# Altium schematic sheet Snippet of MS9333_Main.SchDoc
size A4
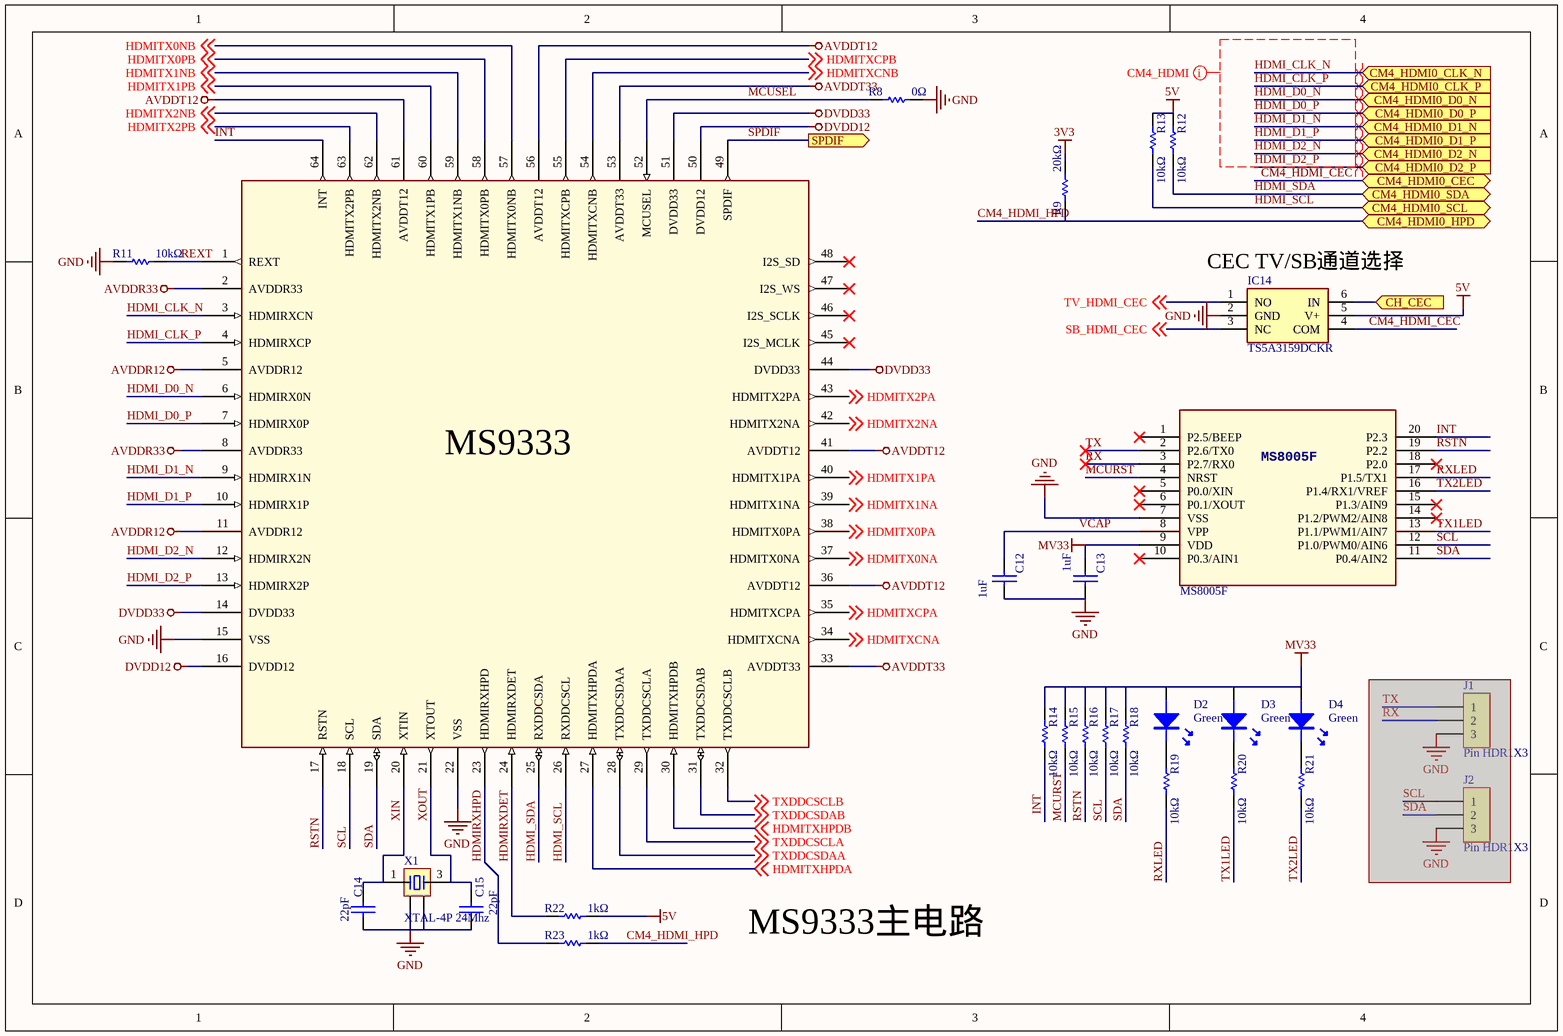
[diagram p0: Snippet of MS9333_Main.SchDoc]

## Parts
C12  1uF  [C_0402]
C13  1uF  [C_0402]
C14  22pF  [C_0402]
C15  22pF  [C_0402]
D2  Green  [LED-0603-G]
D3  Green  [LED-0603-G]
D4  Green  [LED-0603-G]
IC14  TS5A3159DCKR  [SOT65P210X110-6N]
J1  Pin HDR1X3  [Pin HDR1X3/2.54mm-S]  (masked out: inside a compile mask, not in the netlist)
J2  Pin HDR1X3  [Pin HDR1X3/2.54mm-S]  (masked out: inside a compile mask, not in the netlist)
R8  0Ω  [R_0402]
R9  20kΩ  [R_0402]
R11  10kΩ  [R_0402]
R12  10kΩ  [R_0402]
R13  10kΩ  [R_0402]
R14  10kΩ  [R_0402]
R15  10kΩ  [R_0402]
R16  10kΩ  [R_0402]
R17  10kΩ  [R_0402]
R18  10kΩ  [R_0402]
R19  10kΩ  [R_0402]
R20  10kΩ  [R_0402]
R21  10kΩ  [R_0402]
R22  1kΩ  [R_0402]
R23  1kΩ  [R_0402]
U2  MS9333  [LQFP64-0.5]  (value not drawn)
U3  MS8005F  [TSSOP20]
X1  XTAL-4P 24Mhz  [OSC 3225-4P]

## Ports
CH_CEC (in), CM4_HDMI0_CEC (bidir), CM4_HDMI0_CLK_N (in), CM4_HDMI0_CLK_P (in), CM4_HDMI0_D0_N (in), CM4_HDMI0_D0_P (in), CM4_HDMI0_D1_N (in), CM4_HDMI0_D1_P (in), CM4_HDMI0_D2_N (in), CM4_HDMI0_D2_P (in), CM4_HDMI0_HPD (bidir), CM4_HDMI0_SCL (bidir), CM4_HDMI0_SDA (bidir), SPDIF (out)

## Nets
3V3: R9.2
5V: IC14.5(V+) R12.1 R13.1 R22.2
AVDDR12: U2.5(AVDDR12) U2.11(AVDDR12)
AVDDR33: U2.2(AVDDR33) U2.8(AVDDR33)
AVDDT12: U2.36(AVDDT12) U2.41(AVDDT12) U2.56(AVDDT12) U2.61(AVDDT12)
AVDDT33: U2.33(AVDDT33) U2.53(AVDDT33)
DVDD12: U2.16(DVDD12) U2.50(DVDD12)
DVDD33: U2.14(DVDD33) U2.44(DVDD33) U2.51(DVDD33)
GND: C12.1 C13.2 C14.2 C15.2 IC14.2(GND) R8.2 R11.1 U2.15(VSS) U2.22(VSS) U3.7(VSS) X1.2 X1.4
MV33: C13.1 D2.A D3.A D4.A R14.1 R15.1 R16.1 R17.1 R18.1 U3.9(VDD)
CH_CEC: IC14.6(IN) ; port CH_CEC
CM4_HDMI_CEC: IC14.4(COM) ; port CM4_HDMI0_CEC
CM4_HDMI_HPD: R9.1 R23.2 ; port CM4_HDMI0_HPD
HDMI_CLK_N: U2.3(HDMIRXCN) ; port CM4_HDMI0_CLK_N
HDMI_CLK_P: U2.4(HDMIRXCP) ; port CM4_HDMI0_CLK_P
HDMI_D0_N: U2.6(HDMIRX0N) ; port CM4_HDMI0_D0_N
HDMI_D0_P: U2.7(HDMIRX0P) ; port CM4_HDMI0_D0_P
HDMI_D1_N: U2.9(HDMIRX1N) ; port CM4_HDMI0_D1_N
HDMI_D1_P: U2.10(HDMIRX1P) ; port CM4_HDMI0_D1_P
HDMI_D2_N: U2.12(HDMIRX2N) ; port CM4_HDMI0_D2_N
HDMI_D2_P: U2.13(HDMIRX2P) ; port CM4_HDMI0_D2_P
HDMI_SCL: R13.2 U2.26(RXDDCSCL) ; port CM4_HDMI0_SCL
HDMI_SDA: R12.2 U2.25(RXDDCSDA) ; port CM4_HDMI0_SDA
HDMIRXDET: R22.1 U2.24(HDMIRXDET)
HDMIRXHPD: R23.1 U2.23(HDMIRXHPD)
HDMITX0NA: U2.37(HDMITX0NA) ; off-sheet HDMITX0NA
HDMITX0NB: U2.57(HDMITX0NB) ; off-sheet HDMITX0NB
HDMITX0PA: U2.38(HDMITX0PA) ; off-sheet HDMITX0PA
HDMITX0PB: U2.58(HDMITX0PB) ; off-sheet HDMITX0PB
HDMITX1NA: U2.39(HDMITX1NA) ; off-sheet HDMITX1NA
HDMITX1NB: U2.59(HDMITX1NB) ; off-sheet HDMITX1NB
HDMITX1PA: U2.40(HDMITX1PA) ; off-sheet HDMITX1PA
HDMITX1PB: U2.60(HDMITX1PB) ; off-sheet HDMITX1PB
HDMITX2NA: U2.42(HDMITX2NA) ; off-sheet HDMITX2NA
HDMITX2NB: U2.62(HDMITX2NB) ; off-sheet HDMITX2NB
HDMITX2PA: U2.43(HDMITX2PA) ; off-sheet HDMITX2PA
HDMITX2PB: U2.63(HDMITX2PB) ; off-sheet HDMITX2PB
HDMITXCNA: U2.34(HDMITXCNA) ; off-sheet HDMITXCNA
HDMITXCNB: U2.54(HDMITXCNB) ; off-sheet HDMITXCNB
HDMITXCPA: U2.35(HDMITXCPA) ; off-sheet HDMITXCPA
HDMITXCPB: U2.55(HDMITXCPB) ; off-sheet HDMITXCPB
HDMITXHPDA: U2.27(HDMITXHPDA) ; off-sheet HDMITXHPDA
HDMITXHPDB: U2.30(HDMITXHPDB) ; off-sheet HDMITXHPDB
INT: R14.2 U2.64(INT) U3.20(P2.3)
MCURST: R15.2 U3.4(NRST)
MCUSEL: R8.1 U2.52(MCUSEL)
REXT: R11.2 U2.1(REXT)
RSTN: R16.2 U2.17(RSTN) U3.19(P2.2)
RX: U3.3(P2.7/RX0)
RXLED: R19.2 U3.17(P1.5/TX1)
SB_HDMI_CEC: IC14.3(NC) ; off-sheet SB_HDMI_CEC
SCL: R17.2 U2.18(SCL) U3.12(P1.0/PWM0/AIN6)
SDA: R18.2 U2.19(SDA) U3.11(P0.4/AIN2)
SPDIF: U2.49(SPDIF) ; port SPDIF
TV_HDMI_CEC: IC14.1(NO) ; off-sheet TV_HDMI_CEC
TX: U3.2(P2.6/TX0)
TX1LED: R20.2 U3.13(P1.1/PWM1/AIN7)
TX2LED: R21.2 U3.16(P1.4/RX1/VREF)
TXDDCSCLA: U2.29(TXDDCSCLA) ; off-sheet TXDDCSCLA
TXDDCSCLB: U2.32(TXDDCSCLB) ; off-sheet TXDDCSCLB
TXDDCSDAA: U2.28(TXDDCSDAA) ; off-sheet TXDDCSDAA
TXDDCSDAB: U2.31(TXDDCSDAB) ; off-sheet TXDDCSDAB
VCAP: C12.2 U3.8(VPP)
XIN: C14.1 U2.20(XTIN) X1.1
XOUT: C15.1 U2.21(XTOUT) X1.3
NetD2_K: D2.K R19.1
NetD3_K: D3.K R20.1
NetD4_K: D4.K R21.1

Not connected (* = marked no-connect by the designer): U2 45(I2S_MCLK)* 46(I2S_SCLK)* 47(I2S_WS)* 48(I2S_SD)*; U3 1(P2.5/BEEP)* 5(P0.0/XIN)* 6(P0.1/XOUT)* 10(P0.3/AIN1)* 14(P1.2/PWM2/AIN8)* 15(P1.3/AIN9)* 18(P2.0)*

## Layout directives
differential pair: HDMI_CLK_N, HDMI_CLK_P, HDMI_D0_N, HDMI_D0_P, HDMI_D1_N, HDMI_D1_P, HDMI_D2_N, HDMI_D2_P
net class CM3_HDMI_DIFF: HDMI_CLK_N, HDMI_CLK_P, HDMI_D0_N, HDMI_D0_P, HDMI_D1_N, HDMI_D1_P, HDMI_D2_N, HDMI_D2_P

## Notes on the sheet
- (near IC14) CEC TV/SB通道选择
- MS9333主电路

## Library data of the parts
C12-C15 = Cap_Chip: 贴片电容; 厂家型号: *; 商品编号: *
D2-D4 = LED_Chip: 贴片LED; 厂家型号: *; 商品编号: *
IC14 = TS5A3159DCKR: Integrated Circuit; Manufacturer_Name: Texas Instruments; Datasheet Link: http://www.ti.com/lit/gpn/ts5a3159; Height: 1.1mm; Manufacturer_Part_Number: TS5A3159DCKR; Mouser Part Number: 595-TS5A3159DCKR; Mouser Price/Stock: https://www.mouser.co.uk/ProductDetail/Texas-Instruments/TS5A3159DCKR?qs=0O%2FZFlpUpJU45HxzBuW7FA%3D%3D; Arrow Part Number: TS5A3159DCKR; Arrow Price/Stock: https://www.arrow.com/en/products/ts5a3159dckr/texas-instruments
R8 R9 R11-R23 = Res_Chip: 贴片电阻; 商品编号: *; 厂家型号: *
U2 = MS9333: HDMI 一分二; Manufacturer_Name: MacroSilicon(宏晶微); Manufacturer_Part_Number: MS9333; LCSC: *
U3 = MS8005F_TSSOP20: MCU; Manufacturer_Name: MacroSilicon(宏晶微); Manufacturer_Part_Number: MS8005F; LCSC: *
X1 = XTAL-4P: 4脚无源晶振; Manufacturer_Name: GHC(晶光华); Manufacturer_Part_Number: S3224000151050; LCSC: C426976